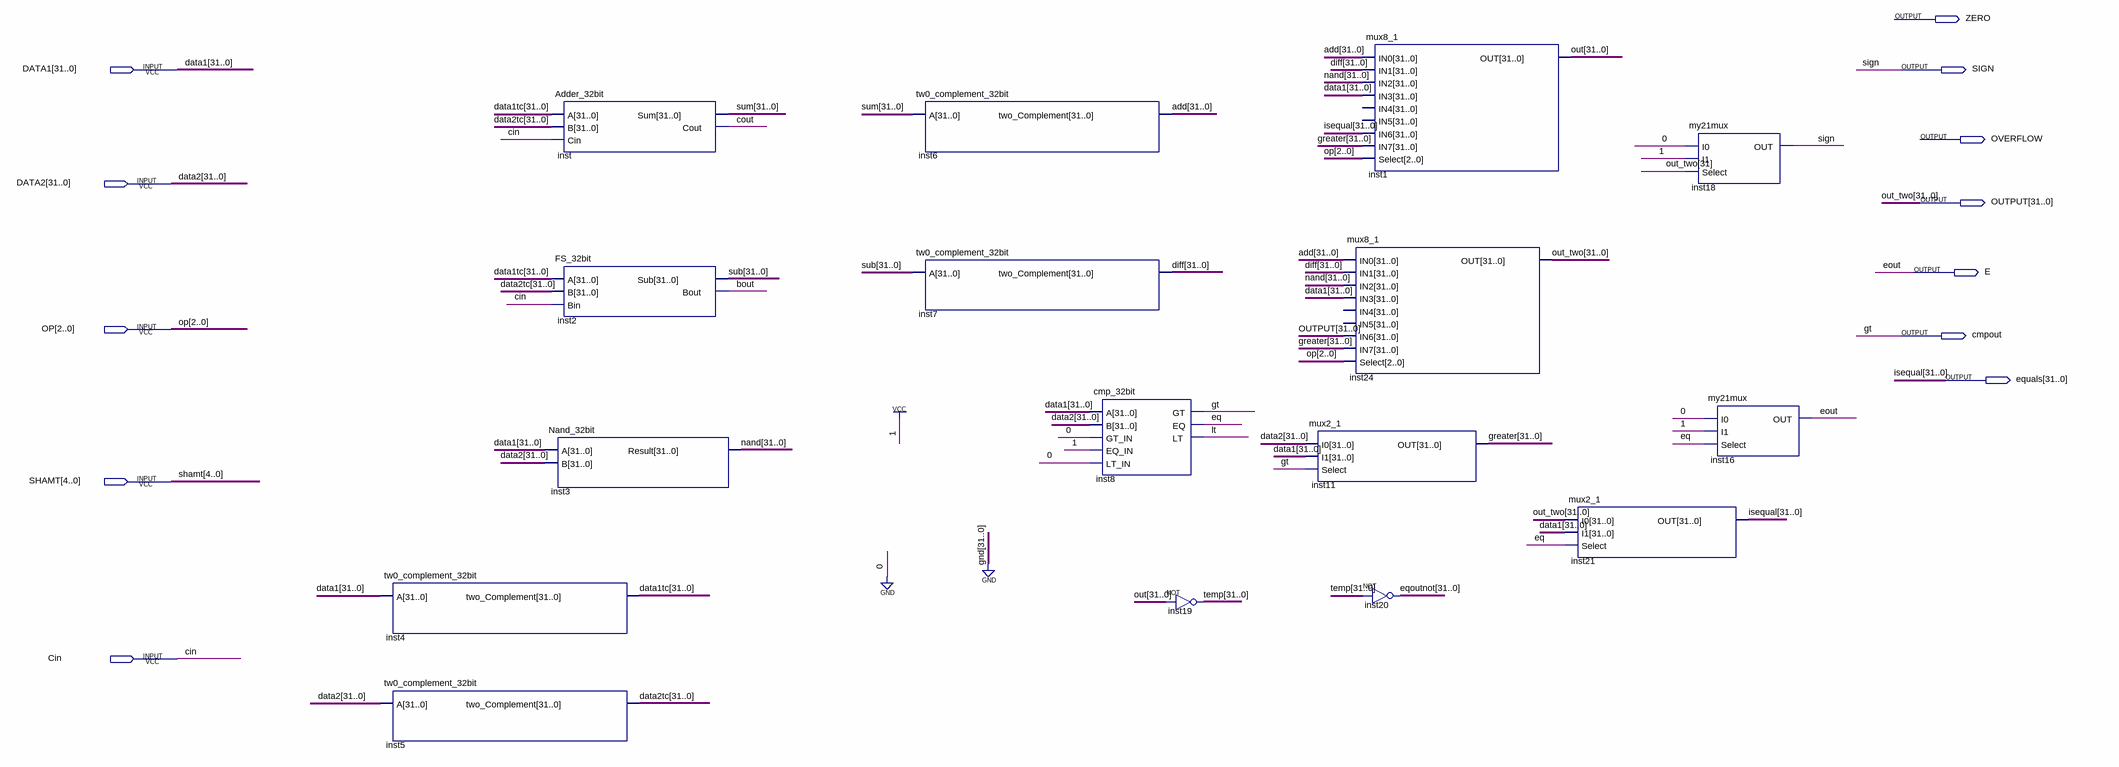
[diagram p0: schematic sheet]
// Quartus schematic ALU.bdf as structural Verilog: 16 symbols, 12 pins
module ALU (
  input  [31:0] DATA1,
  input  [31:0] DATA2,
  input  [2:0] OP,
  input  [4:0] SHAMT,
  input  Cin,
  output ZERO,
  output SIGN,
  output OVERFLOW,
  output [31:0] OUTPUT,
  output E,
  output cmpout,
  output [31:0] equals
);

  wire bout, cout, eq, lt;
  wire [31:0] add, data1tc, data2tc, diff, eqoutnot, greater, \nand , out, sub, sum, temp;

  tw0_complement_32bit inst4 (.A(DATA1), .two_Complement(data1tc));
  tw0_complement_32bit inst5 (.A(DATA2), .two_Complement(data2tc));
  Adder_32bit inst (.A(data1tc), .B(data2tc), .Cin(Cin), .Sum(sum), .Cout(cout));
  FS_32bit inst2 (.A(data1tc), .B(data2tc), .Bin(Cin), .Sub(sub), .Bout(bout));
  Nand_32bit inst3 (.A(DATA1), .B(DATA2), .Result(\nand ));
  tw0_complement_32bit inst6 (.A(sum), .two_Complement(add));
  tw0_complement_32bit inst7 (.A(sub), .two_Complement(diff));
  cmp_32bit inst8 (.A(DATA1), .B(DATA2), .GT_IN(1'b0), .EQ_IN(1'b1), .LT_IN(1'b0), .GT(cmpout), .EQ(eq), .LT(lt));
  assign temp = ~out;  // NOT inst19, 32 bits wide
  mux2_1 inst11 (.I0(DATA2), .I1(DATA1), .Select(cmpout), .OUT(greater));
  mux8_1 inst1 (
    .IN0(add), .IN1(diff), .IN2(\nand ), .IN3(DATA1), .IN6(equals), .IN7(greater), .Select(OP), .OUT(out));  // open: IN4, IN5
  mux8_1 inst24 (
    .IN0(add), .IN1(diff), .IN2(\nand ), .IN3(DATA1), .IN6(OUTPUT), .IN7(greater), .Select(OP), .OUT(OUTPUT));  // open: IN4, IN5
  assign eqoutnot = ~temp;  // NOT inst20, 32 bits wide
  mux2_1 inst21 (.I0(OUTPUT), .I1(DATA1), .Select(eq), .OUT(equals));
  my21mux inst18 (.I0(1'b0), .I1(1'b1), .Select(OUTPUT[31]), .OUT(SIGN));
  my21mux inst16 (.I0(1'b0), .I1(1'b1), .Select(eq), .OUT(E));

  // Other names for the same wires on the sheet: eout = E; gt = cmpout; isequal[31:0] = equals;
  //   out_two[31:0] = OUTPUT
endmodule
